# Altium schematic sheet relay.SchDoc
size A4
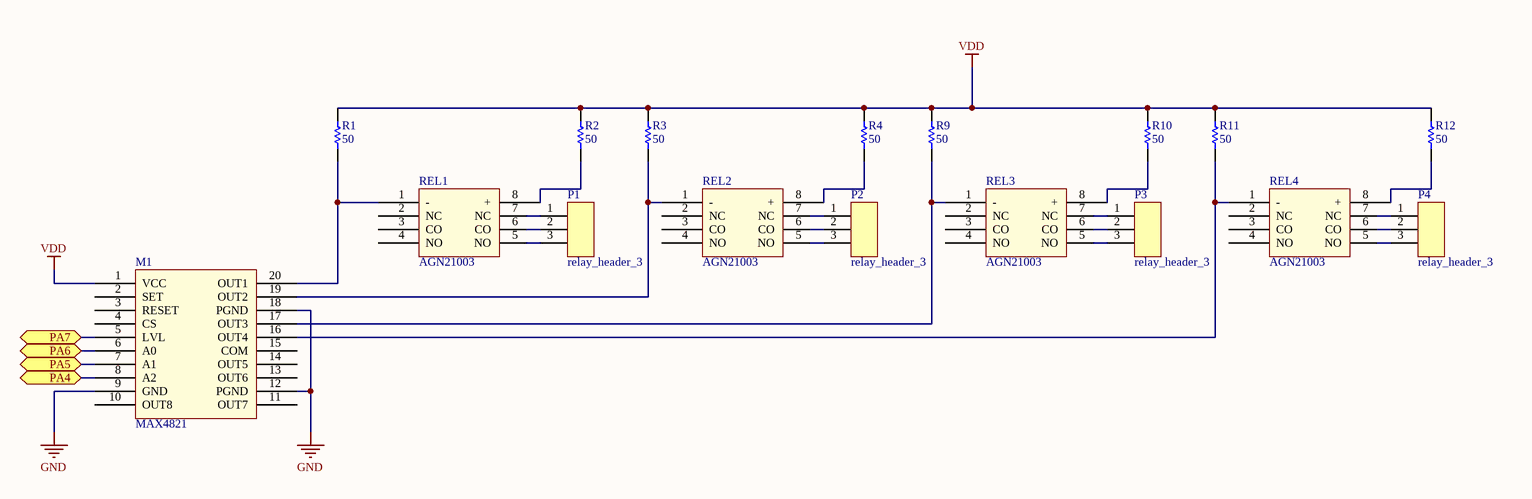
[diagram p0: relay.SchDoc]

## Parts
M1  MAX4821  [TSSOP20]
P1  relay_header_3  [relay_header_3]
P2  relay_header_3  [relay_header_3]
P3  relay_header_3  [relay_header_3]
P4  relay_header_3  [relay_header_3]
R1  50  [0603R]
R2  50  [0603R]
R3  50  [0603R]
R4  50  [0603R]
R9  50  [0603R]
R10  50  [0603R]
R11  50  [0603R]
R12  50  [0603R]
REL1  AGN21003  [AGN21003]
REL2  AGN21003  [AGN21003]
REL3  AGN21003  [AGN21003]
REL4  AGN21003  [AGN21003]

## Ports
PA4, PA5, PA6, PA7

## Nets
GND: M1.9(GND) M1.12(PGND) M1.18(PGND)
VDD: M1.1(VCC) R1.1 R2.1 R3.1 R4.1 R9.1 R10.1 R11.1 R12.1
PA4: M1.8(A2) ; port PA4
PA5: M1.7(A1) ; port PA5
PA6: M1.6(A0) ; port PA6
PA7: M1.5(LVL) ; port PA7
NetM1_16: M1.16(OUT4) R11.2 REL4.1(-)
NetM1_17: M1.17(OUT3) R9.2 REL3.1(-)
NetM1_19: M1.19(OUT2) R3.2 REL2.1(-)
NetM1_20: M1.20(OUT1) R1.2 REL1.1(-)
NetP1_1: P1.1 REL1.7(NC)
NetP1_2: P1.2 REL1.6(CO)
NetP1_3: P1.3 REL1.5(NO)
NetP2_1: P2.1 REL2.7(NC)
NetP2_2: P2.2 REL2.6(CO)
NetP2_3: P2.3 REL2.5(NO)
NetP3_1: P3.1 REL3.7(NC)
NetP3_2: P3.2 REL3.6(CO)
NetP3_3: P3.3 REL3.5(NO)
NetP4_1: P4.1 REL4.7(NC)
NetP4_2: P4.2 REL4.6(CO)
NetP4_3: P4.3 REL4.5(NO)
NetR2_2: R2.2 REL1.8(+)
NetR4_2: R4.2 REL2.8(+)
NetR10_2: R10.2 REL3.8(+)
NetR12_2: R12.2 REL4.8(+)

Not connected (* = marked no-connect by the designer): M1 2(SET) 3(RESET) 4(CS) 10(OUT8) 11(OUT7) 13(OUT6) 14(OUT5) 15(COM); REL1 2(NC) 3(CO) 4(NO); REL2 2(NC) 3(CO) 4(NO); REL3 2(NC) 3(CO) 4(NO); REL4 2(NC) 3(CO) 4(NO)

## Library data of the parts
R1-R4 R9-R12 = Res1: Resistor; Value: 1K; Published: 8-Jun-2000; Revision: July-2002: Re-released for DXP Platform.; Publisher: Altium Limited